# Altium schematic sheet Sheet3.SchDoc
size A4
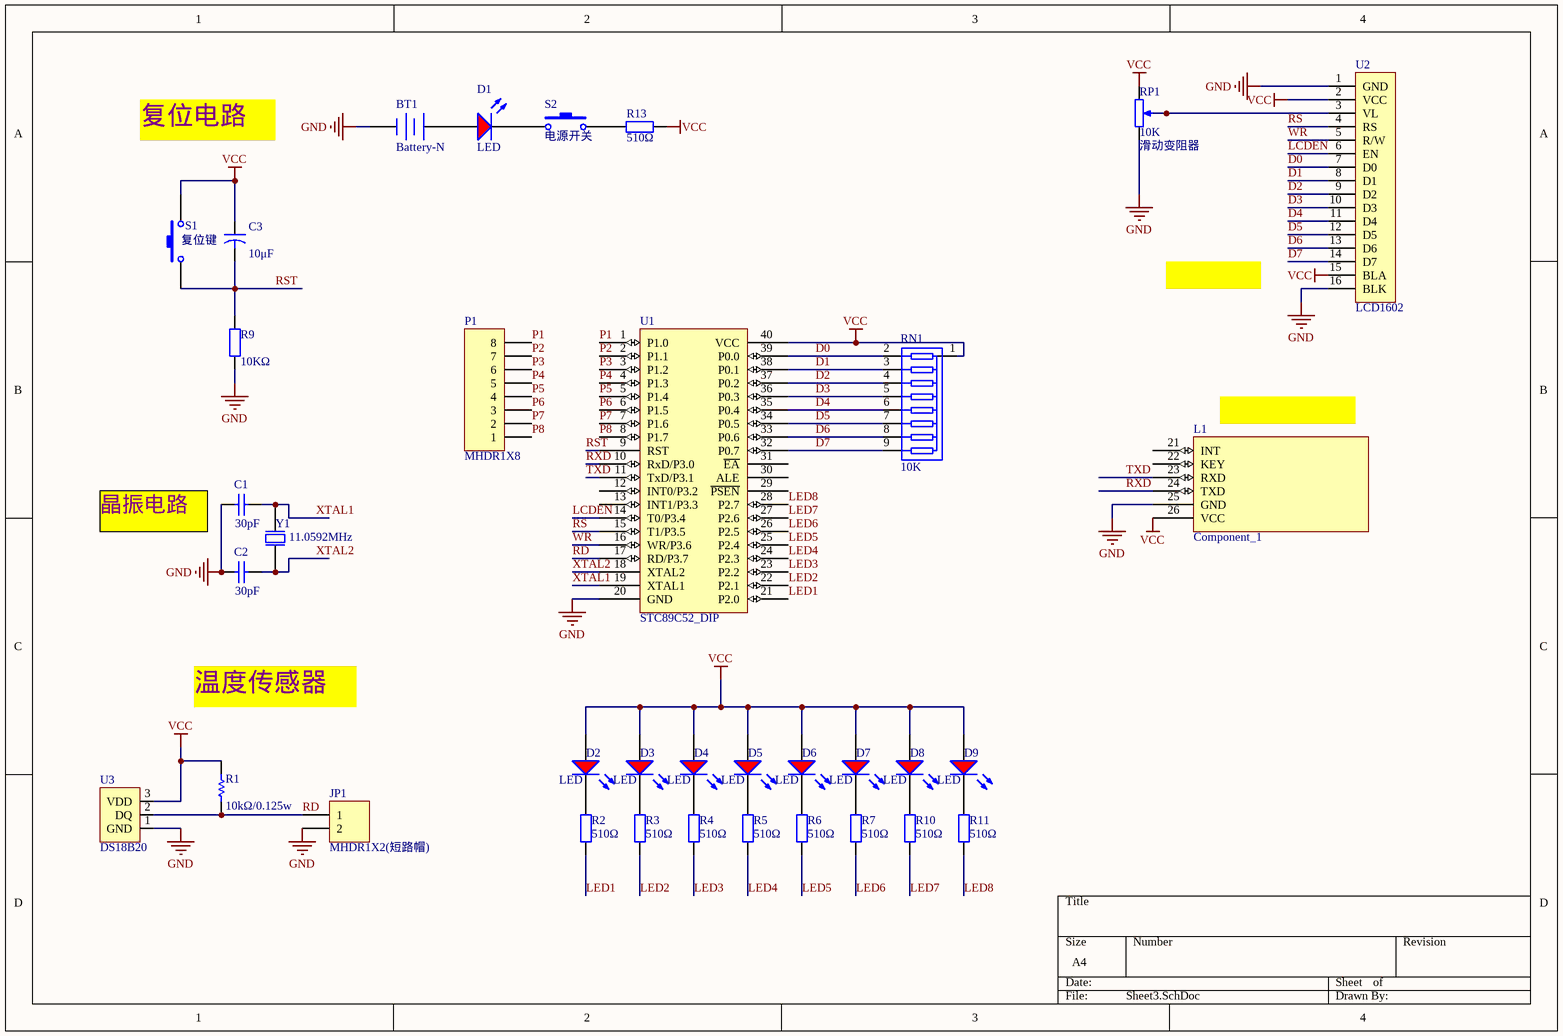
[diagram p0: Sheet3.SchDoc]

## Parts
BT1  Battery-N  [BAT-CR2032]
C1  value 30pF  [RAD-0.3]  (hidden comment: Cap)
C2  value 30pF  [RAD-0.3]  (hidden comment: Cap)
C3  value 10μF  [CAPR5-4X5]  (hidden comment: Cap2)
D1  LED  [LED_#5_Red]
D2  LED  [LED_#5_Red]
D3  LED  [LED_#5_Red]
D4  LED  [LED_#5_Red]
D5  LED  [LED_#5_Red]
D6  LED  [LED_#5_Red]
D7  LED  [LED_#5_Red]
D8  LED  [LED_#5_Red]
D9  LED  [LED_#5_Red]
JP1  MHDR1X2(短路帽)  [MHDR1X2]
L1  Component_1  [PCBComponent_1]
P1  MHDR1X8  [MHDR1X8]
R1  value 10kΩ/0.125w  [AXIAL-0.3]  (hidden comment: Res1)
R2  510Ω  [AXIAL-0.4-R]
R3  510Ω  [AXIAL-0.4-R]
R4  510Ω  [AXIAL-0.4-R]
R5  510Ω  [AXIAL-0.4-R]
R6  510Ω  [AXIAL-0.4-R]
R7  510Ω  [AXIAL-0.4-R]
R9  value 10KΩ  [AXIAL-0.4]  (hidden comment: Res2)
R10  510Ω  [AXIAL-0.4-R]
R11  510Ω  [AXIAL-0.4-R]
R13  510Ω  [AXIAL-0.4-R]
RN1  value 10K  [RES-PACK-DIP9]  (hidden comment: Res_Pack_Single)
RP1  滑动变阻器  value 10K  [POT BIG]
S1  复位键  [BUTTON_6*6]
S2  电源开关  [BUTTON_6*6]
U1  STC89C52_DIP  [DIP-40]
U2  LCD1602  [LCD1602]
U3  DS18B20  [TO-92C]
Y1  Frequency: 11.0592MHz  [XTAL-49/U_N]  (hidden comment: XTAL)

## Nets
GND: BT1.1(-) C1.1 C2.1 JP1.2 L1.25(GND) R9.1 RP1.1(TOP) U1.20(GND) U2.1(GND) U2.16(BLK) U3.1(GND)
VCC: C3.1 D2.1 D3.1 D4.1 D5.1 D6.1 D7.1 D8.1 D9.1 L1.26(VCC) R1.2 R13.1 RN1.1 RP1.2(BOT) S1.2 U1.40(VCC) U2.2(VCC) U2.15(BLA) U3.3(VDD)
D0: RN1.2 U1.39(P0.0) U2.7(D0)
D1: RN1.3 U1.38(P0.1) U2.8(D1)
D2: RN1.4 U1.37(P0.2) U2.9(D2)
D3: RN1.5 U1.36(P0.3) U2.10(D3)
D4: RN1.6 U1.35(P0.4) U2.11(D4)
D5: RN1.7 U1.34(P0.5) U2.12(D5)
D6: RN1.8 U1.33(P0.6) U2.13(D6)
D7: RN1.9 U1.32(P0.7) U2.14(D7)
LCDEN: U1.14(T0/P3.4) U2.6(EN)
LED1: R2.1 U1.21(P2.0)
LED2: R3.1 U1.22(P2.1)
LED3: R4.1 U1.23(P2.2)
LED4: R5.1 U1.24(P2.3)
LED5: R6.1 U1.25(P2.4)
LED6: R7.1 U1.26(P2.5)
LED7: R10.1 U1.27(P2.6)
LED8: R11.1 U1.28(P2.7)
P1: P1.8 U1.1(P1.0)
P2: P1.7 U1.2(P1.1)
P3: P1.6 U1.3(P1.2)
P4: P1.5 U1.4(P1.3)
P5: P1.4 U1.5(P1.4)
P6: P1.3 U1.6(P1.5)
P7: P1.2 U1.7(P1.6)
P8: P1.1 U1.8(P1.7)
RD: JP1.1 R1.1 U1.17(RD/P3.7) U3.2(DQ)
RS: U1.15(T1/P3.5) U2.4(RS)
RST: C3.2 R9.2 S1.1 U1.9(RST)
RXD: L1.24(TXD) U1.10(RxD/P3.0)
TXD: L1.23(RXD) U1.11(TxD/P3.1)
WR: U1.16(WR/P3.6) U2.5(R/W)
XTAL1: C1.2 U1.19(XTAL1) Y1.2(OSC2)
XTAL2: C2.2 U1.18(XTAL2) Y1.1(OSC1)
NetBT1_2: BT1.2(+) D1.1
NetD1_2: D1.2 S2.1
NetD2_2: D2.2 R2.2
NetD3_2: D3.2 R3.2
NetD4_2: D4.2 R4.2
NetD5_2: D5.2 R5.2
NetD6_2: D6.2 R6.2
NetD7_2: D7.2 R7.2
NetD8_2: D8.2 R10.2
NetD9_2: D9.2 R11.2
NetR13_2: R13.2 S2.2
NetRP1_3: RP1.3(TAP) U2.3(VL)

Not connected (* = marked no-connect by the designer): L1 21(INT) 22(KEY); U1 12(INT0/P3.2) 13(INT1/P3.3) 29(~{PSEN}) 30(ALE) 31(~{EA})

## Notes on the sheet
- 复位电路
- LCD屏
- (near L1) 蓝牙模块
- (near C1) 晶振电路
- 温度传感器

## Library data of the parts
BT1 = Battery-N: Multicell Battery; Published: 24-Mar-1999; Revision: July-2002: Re-released for DXP Platform.; Publisher: Altium Limited
C1 C2 = Cap: Capacitor; Published: 8-Jun-2000; LatestRevisionDate: 17-Jul-2002; LatestRevisionNote: Re-released for DXP Platform.; PackageReference: RAD-0.3; Publisher: Altium Limited; PackageDescription: Radial Cap, Thru-Hole; 2 Leads; 0.3 in Pin Spacing
C3 = Cap2: Capacitor; Published: 23-Sep-2002; PackageReference: CAPR5-4X5; Publisher: Altium Limited; PackageDescription: Capacitor; 2 Leads
D1-D9 = LED_5#红灯: 直径5mm的发光二极管; Value: 红灯
JP1 = MHDR1X2: Header, 2-Pin; LatestRevisionDate: 17-Jul-2002; LatestRevisionNote: Re-released for DXP Platform.; Publisher: Altium Limited
P1 = MHDR1X8: Header, 8-Pin; LatestRevisionDate: 17-Jul-2002; LatestRevisionNote: Re-released for DXP Platform.; Publisher: Altium Limited
R1 = Res1: Resistor; Published: 8-Jun-2000; LatestRevisionDate: 17-Jul-2002; LatestRevisionNote: Re-released for DXP Platform.; PackageReference: AXIAL-0.3; Publisher: Altium Limited; PackageDescription: Axial Device, Thru-Hole; 2 Leads; 0.3 in Pin Spacing
R2-R7 R10 R11 R13 = Res2_1/4W: Resistor 直插电阻 0.25W; Published: 8-Jun-2000; LatestRevisionDate: 17-Jul-2002; LatestRevisionNote: Re-released for DXP Platform.; PackageReference: AXIAL-0.4; Publisher: Altium Limited; Value: 510Ω
R9 = Res2: Resistor; Published: 8-Jun-2000; LatestRevisionDate: 17-Jul-2002; LatestRevisionNote: Re-released for DXP Platform.; PackageReference: AXIAL-0.4; Publisher: Altium Limited; PackageDescription: Axial Device, Thru-Hole; 2 Leads; 0.4 in Pin Spacing
RN1 = Res_Pack_Single: 排阻
RP1 = Res Adj Pot: Potentiometer; Set Position: 0.5; Published: 8-Jun-2000; Revision: July-2002: Re-released for DXP Platform.; Publisher: Altium Limited
S1 S2 = SW-PB_1: Switch; Published: 24-Mar-1999; LatestRevisionDate: 17-Jul-2002; LatestRevisionNote: Re-released for DXP Platform.; PackageReference: SPST-2; Publisher: Altium Limited
Y1 = XTAL: Crystal Oscillator; Published: 8-Jun-2000; Revision: July-2002: Re-released for DXP Platform.; Publisher: Altium Limited